# EAGLE board l5 (EAGLE 5.10), part 1 of 2
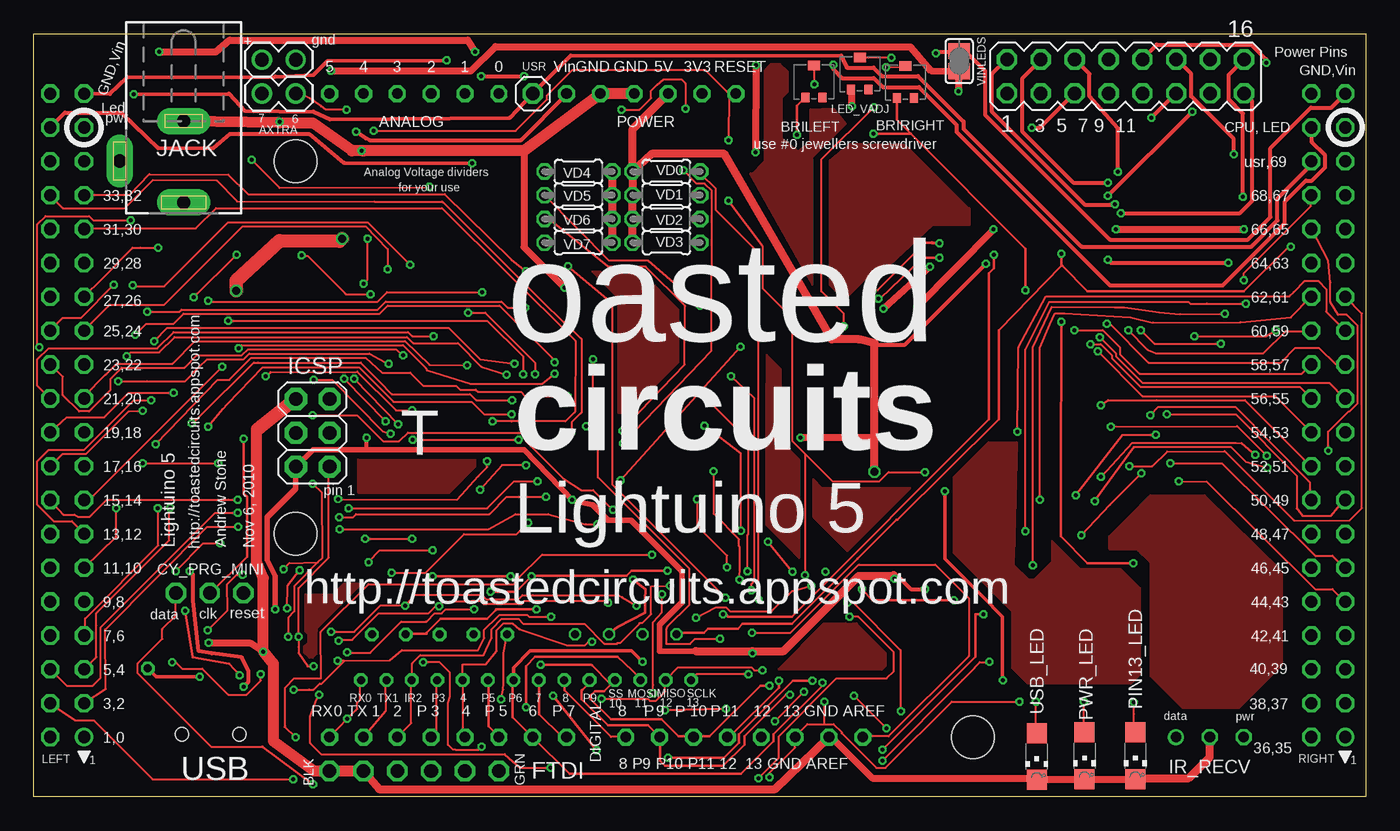
[diagram p2: board, top side]
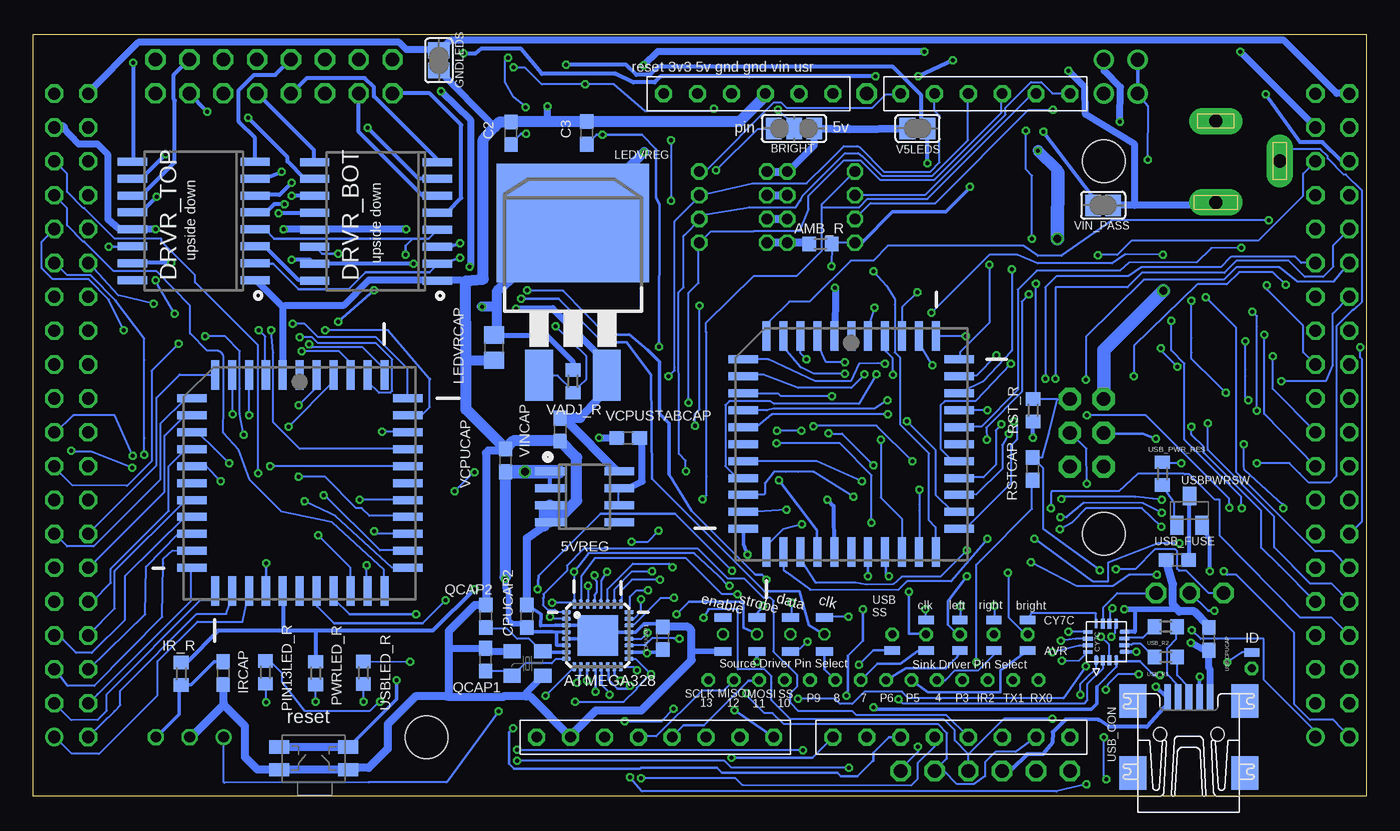
[diagram p3: board, bottom side, seen from below]

Size 100 x 57.14 mm. Coordinates in mm from the lower left corner, seen from the top.
Outline: 0,0 100,0 100,57.14 0,57.14 0,0
Copper layers (1*16): Top 0.035mm / dielectric 1.5mm / Bottom 0.035mm
Design rules "ourpcb *": minimum track width 6mil, minimum drill 0.3mm, track to track 6mil, track to pad 6mil, pad to pad 6mil, via to via 6mil, smd to smd 6mil, copper to edge 0.15mm, drill to drill 8mil, minimum pad ring 0.15mm, minimum via ring 0.15mm, stop-mask expansion 4mil, vias tented up to drill 21mil, thermal gap 10mil
Net classes: 1 PWR: width 0.305 mm, clearance 0.203 mm; 2 GND: width 0.508 mm, clearance 0.203 mm; 3 CHIPCOM: width 0.203 mm, clearance 0.152 mm; 4 solder: clearance 1.524 mm; 5 LEDROW: width 0.305 mm, clearance 0.203 mm; 6 LEDPWR: width 0.381 mm, clearance 0.254 mm

## Footprints (pad centres in the part's own frame; a part is rotated, then mirrored left to right if it is on the bottom)
SO08 = smd 0.6 x 2.2: 1 -1.905,-2.6; 2 -0.635,-2.6; 3 0.635,-2.6; 4 1.905,-2.6; 5 1.905,2.6; 6 0.635,2.6; 7 -0.635,2.6; 8 -1.905,2.6
R0603 = smd 1 x 1.1: 1 -0.85,0; 2 0.85,0
1X02 = drill 1.016 round: 1 0,0; 2 2.54,0
SJ_2 = smd 1.168 x 1.6: 1 -1.524,0; 2 0,0; 3 1.524,0
PVZ2A_TRIM_POT = smd 0.6 x 0.7: P$1 -0.65,-1.2; P$3 0.65,-1.2 | smd 0.9 x 0.7: P$2 0,1.2
RCL_C0603 = smd 1.1 x 1: 1 -0.85,0; 2 0.85,0
MLF32 = smd 0.7 x 0.3: 1 -2.35,1.75; 2 -2.35,1.25; 3 -2.35,0.75; 4 -2.35,0.25; 5 -2.35,-0.25; 6 -2.35,-0.75; 7 -2.35,-1.25; 8 -2.35,-1.75; 17 2.35,-1.75; 18 2.35,-1.25; 19 2.35,-0.75; 20 2.35,-0.25; 21 2.35,0.25; 22 2.35,0.75; 23 2.35,1.25; 24 2.35,1.75 | smd 0.3 x 0.7: 9 -1.75,-2.35; 10 -1.25,-2.35; 11 -0.75,-2.35; 12 -0.25,-2.35; 13 0.25,-2.35; 14 0.75,-2.35; 15 1.25,-2.35; 16 1.75,-2.35; 25 1.75,2.35; 26 1.25,2.35; 27 0.75,2.35; 28 0.25,2.35; 29 -0.25,2.35; 30 -0.75,2.35; 31 -1.25,2.35; 32 -1.75,2.35 | smd 3.048 x 3.048: CENTER 0,0
C0603 = smd 1.1 x 1: 1 -0.85,0; 2 0.85,0
QFN16-3X3 = smd 0.75 x 0.3: P$1 -1.375,0.75; P$2 -1.375,0.25; P$3 -1.375,-0.25; P$10 1.375,-0.25; P$11 1.375,0.25 | smd 0.737 x 0.279: P$4 -1.375,-0.75; P$9 1.375,-0.75; P$12 1.375,0.75 | smd 0.279 x 0.737: P$5 -0.75,-1.375; P$6 -0.25,-1.375; P$7 0.25,-1.375; P$8 0.75,-1.375; P$13 0.75,1.375; P$16 -0.75,1.375 | smd 0.3 x 0.75: P$14 0.25,1.375; P$15 -0.25,1.375
HEADER_3X1 = drill 1.016 octagon: 1 -2.54,0; 2 0,0; 3 2.54,0
SO16W = smd 0.6 x 2.2: 1 -4.445,-4.6; 2 -3.175,-4.6; 3 -1.905,-4.6; 4 -0.635,-4.6; 5 0.635,-4.6; 6 1.905,-4.6; 7 3.175,-4.6; 8 4.445,-4.6; 9 4.445,4.6; 10 3.175,4.6; 11 1.905,4.6; 12 0.635,4.6; 13 -0.635,4.6; 14 -1.905,4.6; 15 -3.175,4.6; 16 -4.445,4.6
1X06-CLEAN = drill 1.016 octagon: 1 -6.35,0; 2 -3.81,0; 3 -1.27,0; 4 1.27,0; 5 3.81,0; 6 6.35,0
SJ = smd 1.168 x 1.6: 1 -0.762,0; 2 0.762,0
2X03 = drill 1.016 pad 1.676 octagon: 1 -2.54,-1.27; 2 -2.54,1.27; 3 0,-1.27; 4 0,1.27; 5 2.54,-1.27; 6 2.54,1.27
TSOP34138 = drill 0.8 round: P$1_OUT -2.54,0 | drill 0.8 octagon: P$2_GND 0,0; P$3_V 2.54,0
DCJ0202 = drill 1 pad 2 long: 1 0,3.1; 2 4.8,0; 3 0,-3
RCL_C0805 = smd 1.3 x 1.5: 1 -0.95,0; 2 0.95,0
D2PACK = smd 2.083 x 3.81: 1 -2.54,-8.89; 3 2.54,-8.89 | smd 11.43 x 8.89: 2 0,2.54
CON-HARTING_CON40L = drill 0.914 round: 1 24.13,1.27 | drill 0.914 octagon: 2 24.13,-1.27; 3 21.59,1.27; 4 21.59,-1.27; 5 19.05,1.27; 6 19.05,-1.27; 7 16.51,1.27; 8 16.51,-1.27; 9 13.97,1.27; 10 13.97,-1.27; 11 11.43,1.27; 12 11.43,-1.27; 13 8.89,1.27; 14 8.89,-1.27; 15 6.35,1.27; 16 6.35,-1.27; 17 3.81,1.27; 18 3.81,-1.27; 19 1.27,1.27; 20 1.27,-1.27; 21 -1.27,1.27; 22 -1.27,-1.27; 23 -3.81,1.27; 24 -3.81,-1.27; 25 -6.35,1.27; 26 -6.35,-1.27; 27 -8.89,1.27; 28 -8.89,-1.27; 29 -11.43,1.27; 30 -11.43,-1.27; 31 -13.97,1.27; 32 -13.97,-1.27; 33 -16.51,1.27; 34 -16.51,-1.27; 35 -19.05,1.27; 36 -19.05,-1.27; 37 -21.59,1.27; 38 -21.59,-1.27; 39 -24.13,1.27; 40 -24.13,-1.27
PLCC44 = smd 0.6 x 2.2: 1 0,8.1; 2 -1.27,8.1; 3 -2.54,8.1; 4 -3.81,8.1; 5 -5.08,8.1; 6 -6.35,8.1; 18 -6.35,-8.1; 19 -5.08,-8.1; 20 -3.81,-8.1; 21 -2.54,-8.1; 22 -1.27,-8.1; 23 0,-8.1; 24 1.27,-8.1; 25 2.54,-8.1; 26 3.81,-8.1; 27 5.08,-8.1; 28 6.35,-8.1; 40 6.35,8.1; 41 5.08,8.1; 42 3.81,8.1; 43 2.54,8.1; 44 1.27,8.1 | smd 2.2 x 0.6: 7 -8.1,6.35; 8 -8.1,5.08; 9 -8.1,3.81; 10 -8.1,2.54; 11 -8.1,1.27; 12 -8.1,0; 13 -8.1,-1.27; 14 -8.1,-2.54; 15 -8.1,-3.81; 16 -8.1,-5.08; 17 -8.1,-6.35; 29 8.1,-6.35; 30 8.1,-5.08; 31 8.1,-3.81; 32 8.1,-2.54; 33 8.1,-1.27; 34 8.1,0; 35 8.1,1.27; 36 8.1,2.54; 37 8.1,3.81; 38 8.1,5.08; 39 8.1,6.35
CHIPLED_1206 = smd 1.5 x 1.5: A 0,-1.75; C 0,1.75
CRYSTAL_ABM8 = smd 1.3 x 1.05: P$1 0,-1.85; P$3 2.3,0; P$GND1 0,0; P$GND2 2.3,-1.85
RA_SWITCH = smd 1.5 x 1: P$1 -2.6,-0.8; P$2 2.6,-0.8; P$3 -2.6,0.9; P$4 2.6,0.9
MA08-2 = drill 1.016 octagon: 1 -8.89,-1.27; 2 -8.89,1.27; 3 -6.35,-1.27; 4 -6.35,1.27; 5 -3.81,-1.27; 6 -3.81,1.27; 7 -1.27,-1.27; 8 -1.27,1.27; 9 1.27,-1.27; 10 1.27,1.27; 11 3.81,-1.27; 12 3.81,1.27; 13 6.35,-1.27; 14 6.35,1.27; 15 8.89,-1.27; 16 8.89,1.27
JUMPER_HOLE_WITH_SMT_DEFAULT_PAD = smd 1.143 x 0.635 bottom: DEFAULT -0.635,1.194 | drill 0.6 pad 1.016 octagon: JPR -0.635,0
SHIELD-OCTAGONALPAD = drill 0.8 pad 1.27 octagon: 0_RX -25.4,27.94; 1_TX -25.4,25.4; 2 -25.4,22.86; 3 -25.4,20.32; 3V3 22.86,0; 4 -25.4,17.78; 5 -25.4,15.24; 5V 22.86,2.54; 6 -25.4,12.7; 7 -25.4,10.16; 8 -25.4,5.715; 9 -25.4,3.175; 10 -25.4,0.635; 11 -25.4,-1.905; 12 -25.4,-4.445; 13 -25.4,-6.985; A_0 22.86,15.24; A_1 22.86,17.78; A_2 22.86,20.32; A_3 22.86,22.86; A_4 22.86,25.4; A_5 22.86,27.94; AREF -25.4,-12.065; GND0 -25.4,-9.525; GND1 22.86,7.62; GND2 22.86,5.08; RESET 22.86,-2.54; VIN 22.86,10.16 | hole 3.2: 17.78,30.48; -10.16,30.48; -25.4,-20.32
LEDSRCSEL = smd 1.27 x 0.635: 1_CLK_DFLT -6.35,1.27; 1_CLK_DFLT1 -6.35,-1.27; 2_DATA_DFLT -3.81,1.27; 2_DATA_DFLT1 -3.81,-1.27; 3_STROBE_DFLT -1.27,1.27; 3_STROBE_DFLT1 -1.27,-1.27; 4_ENA_DFLT 1.27,1.27; 4_ENA_DFLT1 1.27,-1.27 | drill 0.6 octagon: P$1 -6.35,0; P$2 -3.81,0; P$3 1.27,0; P$4 -1.27,0
DUINO_DIGITAL_SOLDER_PTS = drill 0.6 pad 1.016 octagon: IN0 -12.065,-0.635; IN1 -10.16,-0.635; IN2 -8.255,-0.635; IN3 -6.35,-0.635; IN4 -4.445,-0.635; IN5 -2.54,-0.635; IN6 -0.635,-0.635; IN7 1.27,-0.635; IN8 3.175,-0.635; IN9 5.08,-0.635; IN10 6.985,-0.635; IN11 8.89,-0.635; IN12 10.795,-0.635; IN13 12.7,-0.635
QUAD_SOLDER_PTS_WITH_2_DEFAULTS = drill 0.6 pad 1.016 octagon: OUT0 -4.445,0; OUT1 -1.905,0; OUT2 0.635,0; OUT3 3.175,0 | smd 1.143 x 0.635 bottom: OUT0_DFLT -4.445,1.194; OUT0_DFLT1 -4.445,-1.092; OUT1_DFLT -1.905,1.194; OUT1_DFLT1 -1.905,-1.092; OUT2_DFLT 0.635,1.194; OUT2_DFLT1 0.635,-1.092; OUT3_DFLT 3.175,1.194; OUT3_DFLT1 3.175,-1.092
SAMTEC_MUSB_05 = smd 2 x 0.5: 1 2.25,1.6; 2 2.25,0.8; 3 2.25,0; 4 2.25,-0.8; 5 2.25,-1.6 | smd 2.5 x 2: M1 -3.4,-4.2; M2 -3.4,4.2; M3 2,4.2; M4 2,-4.2 | hole 1: -0.5,-2.15; -0.5,2.15
SOT23-BEC = smd 1 x 1.4: B -0.95,-1.1; C 0,1.1; E 0.95,-1.1
1X01 = drill 1.016 octagon: 1 0,0
RCL_R0603 = smd 1 x 1.1: 1 -0.85,0; 2 0.85,0
0204/5 = drill 0.813 octagon: 1 -2.54,0; 2 2.54,0

## Placement (x,y rotation side)
5VREG  SPX2954  [SO08]  58.65,22.48 270 bottom
AMB_R  10k  [R0603]  40.94,41.43 180 bottom
AMS302  Light sensor  [1X02]  17.14,55.24 0 top
AXTRA  [1X02]  19.68,52.71 180 top
BRIGHT  Brightness control selector  [SJ_2]  42.93,50.09 180 bottom
BRILEFT  10k  [PVZ2A_TRIM_POT]  58.57,53.62 0 top
BRIRIGHT  10k  [PVZ2A_TRIM_POT]  65.43,53.57 0 top
C2  1nF  [RCL_C0603]  64.16,49.73 90 bottom
C3  1nF  [RCL_C0603]  58.47,49.76 90 bottom
CPU  MEGA48/88/168  [MLF32]  57.66,12.06 0 bottom
CPUCAP1  .1uF  [C0603]  52.78,11.86 90 bottom
CPUCAP2  .1uF  [C0603]  62.97,13.51 90 bottom
CY7C64316  USB_CPU_CY7C64315  [QFN16-3X3]  19.51,11.58 90 bottom
CY_PRG_MINI  CY_PRG_MIN  [HEADER_3X1]  13.23,15.24 180 top
DRVR_BOT  MIC5891  [SO16W]  74.3,43.13 90 bottom
DRVR_TOP  MIC5891  [SO16W]  87.96,43.15 90 bottom
FTDI  [1X06-CLEAN]  28.57,1.91 0 top
GNDLEDS  [SJ]  69.57,55.19 90 bottom
ICSP  [2X03]  20.96,27.26 90 top
IR_R  100  [R0603]  88.9,9.19 90 bottom
IR_RECV  TSOP34138_IR_RECIEVER  [TSOP34138]  88.27,4.45 0 top
IRCAP  0.1uF  [RCL_C0603]  85.75,9.25 270 bottom
JACK  DCJ0202  [DCJ0202]  11.28,47.65 180 top
LED_VADJ  Led Voltage Adjust  [PVZ2A_TRIM_POT]  62,54.2 0 top
LEDVRCAP  4.7uF  [RCL_C0805]  65.43,33.66 270 bottom
LEDVREG  [D2PACK]  59.51,40.46 0 bottom
LEFT  [CON-HARTING_CON40L]  2.54,28.57 270 top
M5451_LEFT  STONE_ST-M5451  [PLCC44]  38.63,26.42 0 bottom
M5451_RIGHT  STONE_ST-M5451  [PLCC44]  80.01,23.49 0 bottom
PIN13_LED  [CHIPLED_1206]  82.68,3.05 180 top
PIN13LED_R  1K  [R0603]  82.58,9.3 270 bottom
PWR_LED  [CHIPLED_1206]  78.87,3.05 180 top
PWRLED_R  1K  [R0603]  78.82,9.25 270 bottom
Q1  ABM8  [CRYSTAL_ABM8]  64.08,10.9 0 bottom
QCAP1  33pf  [C0603]  66.07,10.26 90 bottom
QCAP2  33pF  [C0603]  66.04,13.51 90 bottom
RESET_SWITCH  RA_SWITCH  [RA_SWITCH]  78.97,2.79 0 bottom
RIGHT  [CON-HARTING_CON40L]  97.16,28.57 270 top
ROW_DRIVER  Source driver  [MA08-2]  81.94,54 0 top
RST_R  10K  [R0603]  24.99,28.96 90 bottom
RSTCAP  1nF  [RCL_C0603]  25.02,24.56 90 bottom
SJ1  [JUMPER_HOLE_WITH_SMT_DEFAULT_PAD]  34.92,12.14 180 top
U$3  ARDUINO-USBOCTAGONAL_PADS  [SHIELD-OCTAGONALPAD]  50.16,29.84 90 top
U$5  LEDSRCSEL  [LEDSRCSEL]  46.99,12.14 180 bottom
U$6  DUINO_DIGITAL_SOLDER_PTS  [DUINO_DIGITAL_SOLDER_PTS]  36.65,9.35 0 top
U$7  QUAD_SOLDER_PTS_WITH_2_DEFAULTS  [QUAD_SOLDER_PTS_WITH_2_DEFAULTS]  28.57,12.14 180 top
USB_CON  MINI-USB-SAMTEC  [SAMTEC_MUSB_05]  13.31,5.16 90 bottom
USB_FUSE  PTC-  [RCL_C0603]  14.17,17.73 0 bottom
USB_LED  [CHIPLED_1206]  75.29,3 180 top
USB_PWR_RES  2.5k  [R0603]  15.29,24.21 270 bottom
USB_R1  22  [R0603]  15.04,10.44 180 bottom
USB_R2  22  [R0603]  15.04,12.73 180 bottom
USBCPUCAP  .1uF  [C0603]  11.81,11.81 270 bottom
USBID  usb id  [JUMPER_HOLE_WITH_SMT_DEFAULT_PAD]  9.22,9.6 0 top
USBLED_R  1K  [R0603]  75.23,9.27 270 bottom
USBPWRSW  MMBT540LT1SMD  [SOT23-BEC]  13.26,21.44 0 bottom
USR  [1X01]  37.47,52.71 0 top
V5LEDS  [SJ]  33.66,50.09 0 bottom
VADJ_R  470  [RCL_R0603]  59.51,31.12 270 bottom
VCPUCAP  >=3.3uF  [RCL_C0603]  64.57,25.2 90 bottom
VCPUSTABCAP  .01uF  [C0603]  55.37,26.87 0 bottom
VD0  [0204/5]  47.5,46.86 0 top
VD1  [0204/5]  47.5,45.09 0 top
VD2  [0204/5]  47.5,43.31 0 top
VD3  [0204/5]  47.5,41.53 0 top
VD4  [0204/5]  40.89,46.86 180 top
VD5  [0204/5]  40.89,45.09 180 top
VD6  [0204/5]  40.89,43.31 180 top
VD7  [0204/5]  40.89,41.53 180 top
VIN_PASS  [SJ]  19.74,44.32 180 bottom
VINCAP  >1uF  [C0603]  60.48,27.51 270 bottom
VINLEDS  [SJ]  69.47,55.14 90 top

## Tracks (layer width: path | path; a pad name or v marks a point on that pad's centre or on a via)
+5V  (via drill 0.3, 0.6)
  Top 0.305: v71.48,39.93 65.41,33.88 63.27,33.88 63.12,33.98 | v89.66,40.01 80.85,40.01 v80.62,40.23 | 24.99,26.01 v24.99,26.9 | 53.95,10.9 v53.95,10.74 | 40.51,22.16 v40.44,22.25 | v66.9,15.54 65.84,15.54 64.85,16.54 64.57,16.61 | 64.49,16.54 v64.62,16.31
  Top 0.406: v18.16,14.02 18.16,16.51 17.55,17.75 17.55,20.93 19.69,23.07 ICSP.2 20.98,26.01 24.99,26.01 36.83,26.01 40.51,22.16 41.96,21.87 43.1,20.7 44.86,20.7 48.67,16.87 48.67,14.55 46.99,12.85 46.99,10.9 49.68,10.9
  Top 0.508: 63.12,26.9 v57.56,26.9
  Top 0.61: U$3.5V 44.96,50.04 VD0.1 | v63.12,24.36 63.12,26.9 63.12,33.98 61.92,34.27 59.92,34.27 58.37,36.96 51.84,48.18 46.41,48.18 VD0.1 | 49.68,10.9 53.95,10.9 56.29,10.9 61.92,16.54 64.49,16.54 64.57,16.61 | VD3.1 VD2.1 VD1.1 | VD4.1 VD7.1 | VD0.1 44.96,45.11 44.91,45.06
  Bottom 0.254: CPU.18 53.95,10.81 52.55,10.81 CPUCAP1.1 | 61.06,12.34 CPU.4 | 61.06,12.34 62.61,12.34 62.75,12.88 CPUCAP2.1 | CPU.6 60.01,11.33 60.76,11.33 60.76,12.31 61.06,12.34
  Bottom 0.305: 56.24,26.9 VCPUSTABCAP.1 | 5VREG.2 61.27,23.16 61.27,23.85 61.26,24.34 | 5VREG.1 61.27,24.38 61.27,24.34 | v71.48,39.93 78.87,39.93 DRVR_BOT.15 79.02,40.01 79.25,40.23 v80.62,40.23 | v89.66,40.01 92.51,40.01 DRVR_TOP.15 | 78.82,12.42 81.23,12.42 | 81.23,12.42 81.23,14.71 81.23,15.39 M5451_RIGHT.22 | 78.82,12.42 PWRLED_R.1 | IR_R.2 88.88,10.06 88.47,10.06 86.13,12.42 81.23,12.42 | 78.82,12.42 81.23,12.42 | CY7C64316.P$8 17.37,12.34 17.37,14.02 v18.16,14.02 | v24.99,26.9 RST_R.1 | v53.95,10.74 53.95,10.81 | v40.44,22.25 39.95,21.77 39.93,18.36 M5451_LEFT.22 | 78.82,12.42 70.03,12.42 v66.9,15.54 | 78.82,12.42 78.79,12.42 78.82,12.42 | 78.82,12.42 81.23,12.42 | 43.47,43.24 43.51,43.28 VD6.1 | VD4.1 43.2,47.02 | BRIGHT.1 41.53,49.84
  Bottom 0.406: 64.62,16.43 v64.62,16.31 64.62,15.65 64.34,15.37 64.34,13.21 64.06,12.93 63.23,12.93 CPUCAP2.1 | v18.16,14.02 17.37,14.02 14.24,14.02 14.38,14.26
  Bottom 0.508: v57.56,26.9 56.24,26.9 | 43.2,47.02 42.06,48.16 41.4,48.82 BRIGHT.1
  Bottom 0.61: VD1.1 VD5.1 | VD0.1 VD4.1 | VD2.1 VD6.1 | VD3.1 VD7.1 43.43,41.55 41.91,41.55 41.91,41.43 AMB_R.2 | BRIGHT.1 38.79,50.04 V5LEDS.1 | 11.96,12.66 USBCPUCAP.1 11.81,12.78 12.9,13.87 14.02,13.87 14.38,14.26 14.5,14.4 14.5,15.91 USB_FUSE.1 | 60.54,24.33 63.09,24.33 v63.12,24.36 | 43.43,43.28 43.47,43.24 43.48,43.23
  Bottom 0.813: VCPUCAP.1 64.57,16.48 64.62,16.43
  Bottom 1.016: VCPUCAP.1 61.27,24.34 61.26,24.34 61.19,24.34 61.19,24.33 60.54,24.33
BRIGHT_NET  (via drill 0.3)
  Top 0.152: v48.77,46.94 49.76,45.95 50.37,45.95 50.9,45.41 50.88,33.43 v44.25,26.47 | v26.87,16.76 26.9,16.76 29.41,16.76 32.31,19.66 36.27,19.66 37.11,20.5 v37.13,20.52
  Bottom 0.152: v48.77,46.94 45.64,50.06 44.5,50.06 BRIGHT.3 | v44.25,26.47 39.47,26.47 37.11,24.08 v37.13,20.52 | v26.87,16.76 26.82,16.76 26.82,13.41 25.6,12.19 25.45,12.19 U$7.OUT3
BRISEL0  (via drill 0.3)
  Top 0.203: 64.77,52.35 BRIRIGHT.P$1 64.78,50.74 65.84,49.68 | v82.53,17.5 79.1,17.5 77.09,19.51 77.09,22.1 77.09,23.6 v77.11,35.59 | v74.45,37.95 74.45,41.07 65.84,49.68 | 65.84,49.68 v63.02,49.68
  Bottom 0.203: v63.02,49.68 63.4,49.68 64.16,48.92 C2.1 | v82.53,17.5 82.53,15.47 M5451_RIGHT.21 | v77.11,35.59 v74.45,37.95
BRISEL1  (via drill 0.3)
  Top 0.203: BRILEFT.P$1 57.3,51.8 v57.3,49.61 | v44.07,23.7 v53.06,33.71
  Bottom 0.203: C3.1 58.45,48.92 57.76,49.61 v57.3,49.61 54.33,49.61 53.26,48.54 53.26,44.88 53.03,44.42 v53.06,33.71 | v44.07,23.7 41.22,19.96 41.22,18.36 M5451_LEFT.21
CLK  (via drill 0.3)
  Top 0.203: v34.29,15.34 36.27,15.35 | 36.27,15.35 36.28,15.35 | v62.15,15.54 62.94,14.71 v69.06,14.71 | v37.36,16.51 37.41,16.54 | v37.36,16.51 37.34,16.46 36.27,15.39 36.27,15.35 | v37.36,16.51 37.49,16.54 44.5,16.54 44.88,16.92 47.55,16.92 v47.57,16.92
  Bottom 0.203: v34.29,15.34 34.29,12.19 33.07,12.19 U$7.OUT0 | v37.36,16.51 37.34,18.29 M5451_LEFT.24 | v62.15,15.54 62.1,16.54 57.45,21.18 51.87,21.18 v47.57,16.92 | M5451_RIGHT.24 78.72,15.39 78.72,14.25 77.44,12.98 70.79,12.98 v69.06,14.71
CLK1
  Bottom 0.152: QCAP2.1 65.99,12.57 64.47,12.57 63.7,11.81 62.79,11.81 61.87,10.9 Q1.P$3
  Bottom 0.254: CPU.7 61.7,10.81 Q1.P$3
CLK2
  Bottom 0.152: 63.7,9.37 64.01,9.07 Q1.P$1 63.7,9.37 | 63.7,9.37 63.09,9.98 61.11,9.98 60.81,10.29 60.05,10.29 CPU.8 | 63.7,9.37 65.99,9.37 QCAP1.1
CPUVOLTAGESEL2IDE  (via drill 0.3)
  Top 0.305: v32.92,47.47 23.29,47.52 20.68,49.68 14.76,49.68 13.51,48.64 9.37,48.62 6.6,51.26 2.36,51.28 1.29,50.22 LEFT.38 | v60.02,54.86 60.02,54.53 60.68,53.87 63.07,53.87 63.75,53.19 66.45,53.19 69.27,50.37 69.27,49.84 80.77,38.33 89.23,38.33 93.88,42.98 93.88,44.58 95.48,46.18 95.94,46.18 96.93,47.17 96.93,48.08 95.94,49.07 95.94,50.14 RIGHT.38
  Bottom 0.305: v32.92,47.47 32.92,50.06 V5LEDS.2 32.92,50.22 33.38,50.67 33.38,52.58 35.51,54.71 53.09,54.74 53.72,54.1 54.76,54.1 55.52,54.86 v60.02,54.86
DATA0  (via drill 0.3)
  Top 0.203: v58.45,8.69 57,8.69 52.96,4.65 52.96,4.04 51.82,2.9 v47.62,2.9 | U$6.IN7 37.95,8.69 37.95,6.17 39.62,4.5 40.01,4.5 U$3.7
  Bottom 0.203: U$7.OUT0_DFLT 33.07,10.9 33.68,10.9 34.95,9.96 36.68,9.96 U$6.IN7 | v58.45,8.69 58.45,9.68 CPU.11 | v47.62,2.9 41.53,2.9 40.01,4.42 U$3.7
DATA1  (via drill 0.3)
  Top 0.203: v64.01,5.11 v61.57,7.54 | U$6.IN5 34.14,8.69 34.14,5.26 34.9,4.5 U$3.5
  Bottom 0.203: U$7.OUT3_DFLT 25.45,10.9 27.43,9.45 27.43,7.8 32.89,7.8 U$6.IN5 | v61.57,7.54 59.44,9.68 CPU.9 | v64.01,5.11 64.31,4.8 64.31,3.73 64.31,2.44 63.93,2.06 54.48,2.06 54.41,2.13 48.69,2.13 48.34,1.78 39.67,1.78 39.4,1.5 38.15,1.5 37.03,2.62 36.96,2.67 36.96,3.28 35.81,4.42 35.05,4.42 U$3.5 34.98,4.42
GND  (via drill 0.3, 0.6)
  Top 0.254: 17.25,10.9 v17.25,10.85
  Top 0.508: v61.42,51.74 61.42,52.96 LED_VADJ.P$1 | v13.16,11.53 16.26,11.51 17.25,10.9 | 18.43,50.51 v18.47,50.6 | U$3.GND0 59.97,4.34 62.94,1.37 75.06,1.37 USB_LED.C 75.29,1.29 PWR_LED.C 79.1,1.29 PIN13_LED.C 82.91,1.37 | 17.06,27.71 16.92,27.89 16.74,27.56 | 36.8,48.41 36.8,41.2 v39.85,38.15
  Top 0.61: U$3.GND0 55.65,0.53 25.93,0.53 24.77,1.88 FTDI.2 | IR_RECV.P$2_GND 88.27,2.95 86.69,1.37 82.91,1.37 82.75,1.37
  Top 0.813: JACK.3 18.43,50.51 19.44,50.49 20.98,50.49 23.9,48.41 36.8,48.41 U$3.GND1 U$3.GND2 | 16.74,27.56 16.74,17.58 17.25,16.38 17.25,10.9 18.01,9.96 18.01,4.17 21.05,1.91 FTDI.1 FTDI.2 | v24.61,48.44 24.89,48.44
  Top 1.016: v15.21,37.92 15.21,38.66 18.47,41.66 22.99,41.63 v23.16,41.81 | 16.84,27.54 17.06,27.71 ICSP.6
  Bottom 0.254: CPUCAP1.2 52.93,12.71 52.93,12.93 54.17,12.94 54.81,12.29 55.29,12.29 CPU.21 57.41,12.31 CPU.CENTER | CPUCAP2.2 61.91,13.66 61.92,12.8 60.85,12.81 CPU.3 58.41,12.81 CPU.CENTER | CPU.5 58.62,11.81 58.62,12.06 CPU.CENTER | CY7C64316.P$5 17.23,10.83 v17.25,10.85
  Bottom 0.406: U$5.4_ENA_DFLT 48.28,10.9 50.62,10.9
  Bottom 0.508: 85.75,8.38 IRCAP.2 85.72,8.46 85.72,8.37 | 81.31,36.73 81.31,31.62 M5451_RIGHT.2 | 81.31,36.73 83.29,38.71 DRVR_TOP.1 | USB_CON.5 11.71,7.47 11.71,7.54 11.71,9.42 11.81,9.68 USBCPUCAP.2 12.04,10.9 v13.16,11.53 | 61.42,50.62 v61.42,51.74 | C3.2 58.45,50.67 58.45,50.62 | 68.83,11.12 QCAP1.2 65.99,10.9 Q1.P$GND1 | Q1.P$GND2 61.8,8.99 63.02,7.77 63.02,7.49 | 65.46,32.69 LEDVRCAP.2 | 67.55,32.67 67.21,32.69 | GNDLEDS.1 69.57,54.41 65.38,50.22 | 39.83,38.09 39.85,34.52 M5451_LEFT.2 | 39.83,38.09 39.83,38.15 | 67.56,38.66 67.97,38.71 69.65,38.71 DRVR_BOT.1 69.95,38.71 74.83,38.71 76.73,36.8 81.08,36.8 81.31,36.73 | v18.47,50.6 18.44,53.19 19.66,54.41 19.66,55.24 AMS302.2 | 82.07,2.13 81.84,2.13 RESET_SWITCH.P$1 82.22,1.98 82.22,2.01 | 75.67,2.13 76.12,2.13 RESET_SWITCH.P$2 | 85.72,6.86 85.72,7.09 | 39.83,38.09 39.85,38.1 v39.85,38.15
  Bottom 0.61: CPUCAP2.2 62.97,19.36 61.65,20.29 5VREG.4 | CPUCAP1.2 50.89,12.71 50.62,12.45 50.62,10.9 50.62,10.26 50.6,10.24 54.38,6.45 57.78,6.45 59.69,4.55 U$3.GND0 62.74,7.49 63.02,7.49 64.73,7.49 | 64.73,7.47 68.83,7.47 68.83,7.67 | VCPUCAP.2 64.68,25.93 65.86,25.93 66.04,25.76 QCAP2.2 66.05,14.35 66.88,14.35 68.83,12.39 68.83,11.12 68.83,8.69 68.83,7.67 | RESET_SWITCH.P$2 RESET_SWITCH.P$1 | 88.16,4.45 85.72,6.88 85.72,7.09 85.72,8.37 | 85.72,6.86 84.12,5.26 84.12,2.95 83.19,2.01 82.22,2.01 81.56,2.01 | 75.67,2.13 74.83,2.13 73.41,3.56 73.41,5.41 71.32,7.49 69.01,7.49 68.83,7.67
  Bottom 0.762: 67.21,32.69 65.46,32.69
  Bottom 0.813: U$3.GND2 45.09,52.53 46.99,50.62 58.45,50.62 61.42,50.62 64.12,50.62 C2.2 65.01,50.58 65.38,50.22 66.24,49.25 66.24,38.79 67.56,38.66 67.55,32.67 67.54,29.03 64.57,26.09 | 64.57,26.09 VCPUCAP.2 | 64.57,26.09 63.99,26.66 VINCAP.2 59.23,25.41 59.23,22.17 60.3,21.11 61.29,21.11 61.25,21.07 5VREG.4 | 5VREG.3 61.65,21.44 61.65,20.29 | 23.14,46.79 23.14,46.96 v24.61,48.44
  Bottom 1.016: ICSP.6 19.69,33.44 v15.21,37.92 | v23.16,41.81 23.14,46.79
GND3
  Bottom 0.508: RIGHT.40 95.94,52.73 92.13,56.54 72.54,56.54 72.01,56.01 69.57,56.01 GNDLEDS.2 69.34,56.08 68.73,56.69 6.17,56.69 2.21,52.73 1.29,52.73 LEFT.40
LEDPWR  (via drill 0.3)
  Top 0.508: v81.23,42.52 v90.83,42.52 | v9.45,55.85 13.72,55.83 14.73,56.72 32.59,56.72 v33.15,55.85 | v54.2,54.84 v54.18,48.31 | v72.03,42.52 72.06,42.52 v66.34,36.73
  Bottom 0.381: 78.94,42.52 DRVR_BOT.13 78.72,42.52 | 93.55,42.57 92.73,42.6 DRVR_TOP.13 | 98.37,50.16 RIGHT.37 | VADJ_R.1 59.51,32.61 61.49,34.59 65.23,34.59 65.38,34.59 LEDVRCAP.1 | LEFT.37 3.81,50.22 | 59.51,42.98 LEDVREG.2 59.59,42.82 | 65.23,37.87 65.23,36.73
  Bottom 0.508: 78.94,42.52 v81.23,42.52 | v90.83,42.52 DRVR_TOP.13 | 97.79,50.16 96.6,48.92 95.17,48.92 94.39,48.11 94.39,43.28 93.55,42.57 | 3.81,50.22 v9.45,55.85 | v33.15,55.85 53.16,55.85 v54.2,54.84 | v72.03,42.52 78.72,42.52
  Bottom 0.762: 97.79,50.16 98.37,50.16 | v54.18,48.31 59.51,42.98 | 59.59,42.82 65.23,37.87 65.23,36.73 | 65.23,36.73 65.23,34.59 | 65.23,36.73 v66.34,36.73
LEFTDATA  (via drill 0.3)
  Top 0.203: v29.95,16.51 v35.81,16.51
  Bottom 0.203: v29.95,16.51 31.39,14.63 31.39,12.88 30.71,12.19 30.48,12.19 U$7.OUT1 | M5451_LEFT.25 36.04,18.29 36.04,17.75 36.04,17.25 36.04,16.74 v35.81,16.51
MISO  (via drill 0.3)
  Top 0.152: v54.71,9.45 54.1,9.45 53.87,9.68 48.39,9.68 47.47,8.76 U$6.IN12 | ICSP.1 22.17,24.69 22.17,17.91 19.89,15.62 v19.89,11.96 19.89,11.2 19.89,10.74 20.57,9.75 v21.03,9.75 | U$6.IN12 47.4,8.69 | v42.62,7.31 42.67,7.31 46.1,7.31 46.25,7.16 46.71,7.16 47.4,7.85 47.4,8.61 U$6.IN12
  Bottom 0.152: v54.71,9.45 54.94,9.68 55.85,9.68 CPU.16 | U$3.12 54.56,4.5 53.26,4.5 49.84,7.93 48.23,7.93 U$6.IN12 | v19.89,11.96 19.28,11.35 19.28,10.21 CY7C64316.P$3 | v42.62,7.31 39.85,7.31 39.47,6.93 38.56,6.93 37.64,7.85 37.57,7.85 34.82,7.85 34.37,7.39 34.31,7.37 22.73,7.34 v21.03,9.75
MOSI  (via drill 0.3)
  Top 0.203: v55.93,8.69 55.93,8.15 52.27,4.5 52.12,4.5 U$3.11 | v15.47,9.07 14.71,9.93 11.96,10.44 11.4,13.89 v11.38,13.92 | v15.77,26.82 15.77,22.71 16.03,22.48 16.03,17.98 13.26,15.24 CY_PRG_MINI.2 | v36.96,6.68 36.96,9.75 37.64,10.46 43.81,10.46 45.49,8.91 45.49,8.76 U$6.IN11
  Bottom 0.203: v55.93,8.69 56.39,9.14 56.39,9.68 CPU.15 | U$6.IN11 45.57,8.69 46.33,8.69 49.68,5.33 51.21,5.33 52.05,4.5 U$3.11 | 18.75,10.13 16.99,10.13 15.93,9.07 v15.47,9.07 | v11.38,13.92 11.84,13.92 13.18,15.24 CY_PRG_MINI.2 | 18.75,10.13 CY7C64316.P$4 | v15.77,26.82 16.76,27.2 19.66,27.2 ICSP.4 | 20.22,8.23 18.75,9.7 18.75,10.13
  Bottom 0.254: 20.22,8.23 20.22,6.93 20.62,6.53 36.27,6.53 36.8,6.53 arc90 v36.96,6.68
N$1  (via drill 0.3)
  Top 0.152: v82.55,7.06 82.58,6.17 82.58,4.8 PIN13_LED.A
  Bottom 0.152: v82.55,7.06 82.55,8.38 PIN13LED_R.2
N$2  (via drill 0.3)
  Top 0.152: v63.98,54.69 65.38,54.71 BRIRIGHT.P$2 | v58.6,53.39 58.6,54.79 BRILEFT.P$2 | v44.12,51.51 45.47,51.51 46.35,52.37 46.35,52.93 46.79,53.37 47.27,53.77 48.62,53.77 48.92,53.47 48.92,51.61 v48.95,51.59
  Bottom 0.152: v44.12,51.51 42.98,50.37 42.98,50.14 BRIGHT.2 | v48.95,51.59 49.25,51.38 54.08,51.36 56.46,53.42 58.6,53.42 v58.6,53.39 61.82,53.39 61.87,53.42 63.09,54.63 63.93,54.63 v63.98,54.69
N$3  (via drill 0.3)
  Top 0.152: 47.5,11.43 47.5,11.48 | 47.5,11.43 47.5,11.48 | 47.5,11.48 47.5,12.55 47.6,12.75 49.23,14.38 49.23,17.07 42.37,23.93 42.37,24 42.37,27.36 v42.37,27.41 | v44.22,27.41 44.65,27.96 48.87,32.38 48.9,36.78 45.95,39.73 43.13,39.73 38.71,43.28 38.41,43.28 VD6.2 | v23.5,51.49 21.92,51.51 21.59,51.74 20.73,52.37 19.89,52.76 19.74,52.73 AXTRA.1 | v51.54,11.81 51.51,11.81 49.66,11.81 49.28,11.43 47.55,11.43 47.5,11.43
  Bottom 0.152: CPU.19 54.1,11.33 53.57,11.86 51.97,11.86 | 51.97,11.86 51.87,11.86 | v51.54,11.81 51.56,11.81 51.97,11.86 | v42.37,27.41 v44.22,27.41 | v23.5,51.49 25.35,51.49 32.33,44.5 37.19,44.5 38.33,43.36 VD6.2
N$4  (via drill 0.3)
  Top 0.305: v24.21,49.86 24.97,49.35 25.22,49.23 36.58,49.23 40.01,52.65 U$3.VIN
  Bottom 0.305: v24.21,49.86 20.5,44.96 VIN_PASS.2
N$5  (via drill 0.3)
  Top 0.152: v40.11,39.75 43.28,37.13 43.36,37.11 43.43,37.03 43.43,23.39 43.46,23.37 43.51,23.32 49.45,17.37 51.89,14.93 v51.92,14.88 | v16.38,47.73 18.47,45.64 29.64,45.67 | 29.64,45.67 29.79,45.57 | v29.72,45.72 29.72,45.57 29.64,45.67
  Bottom 0.152: v40.11,39.75 40.08,41.38 AMB_R.1 40.01,41.38 39.85,41.53 VD7.2 | CPU.22 55.24,12.88 54.94,12.88 52.96,14.86 51.97,14.86 v51.92,14.88 | v16.38,47.73 16.36,51.74 AXTRA.2 | v29.72,45.72 29.72,45.64 29.72,45.66
  Bottom 0.254: AXTRA.2 AMS302.1 | VD7.2 37.85,41.53 35.53,43.84 31.54,43.84 29.72,45.66
N$6
  Bottom 0.152: M5451_RIGHT.20 84.3,13.08 87.68,13.11 90.63,10.18 90.68,10.13 90.68,7.59 95.1,3.18 95.1,3.2 95.12,3.2 97.1,3.2 98.37,4.42 RIGHT.1
N$7
  Bottom 0.152: M5451_RIGHT.19 85.11,15.39 85.11,14.86 85.52,13.69 87.76,13.69 93.47,7.93 93.47,6.83 93.9,6.4 95.86,4.5 RIGHT.2
N$8
  Bottom 0.152: M5451_RIGHT.18 86.41,15.39 86.18,14.73 86.77,14.73 87.43,14.73 94.49,7.67 94.49,6.43 95.17,5.74 97.16,5.71 RIGHT.3
N$9
  Bottom 0.152: M5451_RIGHT.17 88.16,17.14 88.16,14.68 95.17,7.67 95.86,7.01 RIGHT.4
N$10
  Bottom 0.152: M5451_RIGHT.16 88.09,18.36 87.55,18.36 89.56,18.44 90.25,17.83 90.25,17.45 90.32,13.46 95.43,8.28 97.41,8.28 98.37,9.52 RIGHT.5
N$11
  Bottom 0.152: M5451_RIGHT.15 88.16,19.66 89.15,19.66 91.54,17.22 91.59,13.64 95.86,9.52 RIGHT.6
N$12
  Bottom 0.152: M5451_RIGHT.14 88.62,20.95 93.12,16.54 93.12,13.26 95.61,10.77 96.8,10.77 98.09,12.06 RIGHT.7
N$13
  Bottom 0.152: M5451_RIGHT.13 88.16,22.17 88.62,22.17 93.88,16.92 93.88,14.1 95.86,12.12 RIGHT.8
N$14  (via drill 0.3)
  Top 0.152: v85.93,23.65 88.04,23.6 96.16,15.54 97.46,15.54 98.37,14.63 RIGHT.9
  Bottom 0.152: v85.93,23.65 87.02,24.77 M5451_RIGHT.11
N$15
  Bottom 0.152: M5451_RIGHT.10 88.16,25.98 88.62,25.98 89.84,24.77 89.84,21.41 94.18,17.07 94.18,16 95.56,14.63 95.86,14.63 RIGHT.10
N$16
  Bottom 0.305: DRVR_BOT.5 69.65,43.81 68.96,43.81 67.89,44.88 67.89,50.37 70.26,52.73 ROW_DRIVER.1
N$17  (via drill 0.3)
  Top 0.152: v85.29,24.99 89.18,24.97 96.16,18.06 97.46,18.06 98.37,17.14 RIGHT.11
  Bottom 0.152: M5451_RIGHT.9 88.09,27.28 87.63,27.28 86.41,26.06 v85.29,24.99
N$18
  Bottom 0.152: M5451_RIGHT.8 88.62,28.57 90.14,27.05 90.14,22.86 95.86,17.14 RIGHT.12
N$19
  Bottom 0.152: M5451_RIGHT.7 88.16,29.79 88.62,29.79 90.45,27.96 90.45,23.77 95.48,18.74 97.46,18.74 98.37,19.66 RIGHT.13
N$20
  Bottom 0.152: 86.41,31.62 M5451_RIGHT.6 86.49,31.62 89,31.62 89.03,31.62 90.75,29.9 90.75,24.84 95.86,19.74 RIGHT.14
N$21  (via drill 0.3)
  Top 0.152: v85.04,28.65 90.22,28.65 94.69,24.16 94.79,24.05 94.79,21.59 95.22,21.06 97.38,21.06 98.37,22.25 RIGHT.15
  Bottom 0.152: v85.04,28.65 85.04,31.55 M5451_RIGHT.5
N$22  (via drill 0.3)
  Top 0.152: v83.82,28.6 84.4,29.21 90.17,29.21 95.78,23.55 95.78,22.33 RIGHT.16
  Bottom 0.152: v83.82,28.6 83.82,29.87 M5451_RIGHT.4
N$23  (via drill 0.3)
  Top 0.152: v83.08,34.98 84.12,33.96 v89.1,33.96
  Bottom 0.152: v89.1,33.96 89.08,33.96 91.14,31.9 91.11,25.15 92.96,23.29 97.08,23.32 98.37,24.61 98.37,24.77 RIGHT.17 | M5451_RIGHT.3 82.6,31.62 82.6,34.49 v83.08,34.98
N$24  (via drill 0.3)
  Top 0.152: v80.09,29.34 80.62,29.72 84.28,29.72 90.91,29.72 95.86,24.77 RIGHT.18
  Bottom 0.152: v80.09,29.34 78.79,30.63 78.79,31.55 M5451_RIGHT.44
N$25  (via drill 0.3)
  Top 0.152: v80.85,27.74 90.32,27.76 v92.53,25.53
  Bottom 0.152: v80.85,27.74 77.5,31.09 77.5,31.55 M5451_RIGHT.43 | v92.53,25.53 93.9,28.57 97,28.57 98.37,27.28 RIGHT.19
N$26  (via drill 0.3)
  Top 0.152: v79.86,33.38 83.21,30.02 93.19,30.02 95.86,27.36 RIGHT.20
  Bottom 0.152: v79.86,33.38 77.04,33.38 76.2,32.54 M5451_RIGHT.42
N$27  (via drill 0.3)
  Top 0.152: v80.01,34.44 81.23,33.22 81.23,32.99 83.21,31.01 97.23,31.01 98.37,29.87 RIGHT.21
  Bottom 0.152: v80.01,34.44 79.1,34.44 78.64,33.98 74.3,33.98 73.08,32.77 73.08,30.4 73.23,30.25 74.07,30.25 74.91,31.09 74.91,31.55 M5451_RIGHT.41
N$28  (via drill 0.3)
  Top 0.152: v79.32,33.91 80.09,33.91 80.92,33.07 80.92,32.84 83.06,30.71 95.02,30.71 RIGHT.22
  Bottom 0.152: v79.32,33.91 79.1,33.68 75.29,33.68 73.69,32.08 73.69,31.62 M5451_RIGHT.40
N$29  (via drill 0.3)
  Top 0.152: v80.54,35.43 80.77,35.43 83.67,32.54 92.63,32.54 92.66,32.54 93.6,32.54 94.69,33.63 96.44,33.63 97.74,32.38 98.37,32.38 RIGHT.23
  Bottom 0.152: v80.54,35.43 79.63,35.43 78.64,34.44 74.3,34.44 71.93,32.08 71.93,29.87 M5451_RIGHT.39
N$30  (via drill 0.3)
  Top 0.152: v78.11,34.98 80.24,34.98 81.53,33.68 81.53,33.15 82.98,31.7 95.17,31.7 95.86,32.38 RIGHT.24
  Bottom 0.152: 70.27,31.33 70.23,31.29 | 70.27,31.33 73.38,34.98 v78.11,34.98 | M5451_RIGHT.38 70.87,28.57 70.26,29.19 70.26,31.24 70.27,31.33
N$31  (via drill 0.3)
  Top 0.152: v73.84,27.36 73.91,33.68 75.97,37.49 94.23,37.49 94.56,37.82 95.4,38.66 96.39,38.66 97,38.05 97,36.35 97.46,35.89 RIGHT.25
  Bottom 0.152: v73.84,27.36 71.93,27.36 M5451_RIGHT.37
N$32  (via drill 0.3)
  Top 0.152: v82.17,34.98 83.59,33.5 84.2,33.22 91.11,33.22 91.14,33.22 92.28,33.22 93.95,34.9 95.86,34.9 RIGHT.26
  Bottom 0.152: v82.17,34.98 81.99,33.3 81.99,28.04 80.01,26.06 71.93,26.06 M5451_RIGHT.36
N$33  (via drill 0.3)
  Top 0.152: v82.25,24.77 83.95,24.77 85.06,25.86 89.38,25.88 94.61,20.68 98.75,20.7 99.67,21.62 99.67,36.2 98.45,37.41 RIGHT.27
  Bottom 0.152: M5451_RIGHT.35 v82.25,24.77
N$34  (via drill 0.3)
  Top 0.152: v75.51,22.25 75.51,33.63 76.25,35.41 76.66,36.22 77.37,36.22 82.32,35.92 84,35.53 90.58,35.56 94.36,35.92 95.83,37.46 RIGHT.28
  Bottom 0.152: v75.51,22.25 71.93,22.25 M5451_RIGHT.33
N$35  (via drill 0.3)
  Top 0.152: v80.11,23.95 80.14,23.95 82.45,26.52 90.22,26.52 90.65,26.49 v91.67,25.6
  Bottom 0.152: v91.67,25.6 91.67,26.9 | 91.67,26.9 91.67,26.82 91.67,26.87 91.67,26.9 | 91.67,26.9 91.67,32.71 | 91.67,32.71 91.67,32.74 | 91.67,32.71 91.67,32.74 | 91.67,32.71 91.67,32.74 | 91.67,32.74 91.67,34.34 93.8,37.19 95.71,39.09 97.46,39.09 98.37,40.01 RIGHT.29 | M5451_RIGHT.32 71.4,20.95 71.48,21.03 74.78,21.03 75.36,21.62 75.77,21.62 78.11,23.95 v80.11,23.95
N$36  (via drill 0.3)
  Top 0.152: v74.42,19.89 74.42,33.5 76.22,37.08 86.67,37.08 86.72,37.03 86.79,36.96 88.01,36.96 88.06,36.96 v90.98,36.96
  Bottom 0.152: 72.47,19.74 71.93,19.74 M5451_RIGHT.31 74.22,19.69 v74.42,19.89 | v90.98,36.96 93.62,37.57 95.86,40.01 RIGHT.30
N$37  (via drill 0.3)
  Top 0.152: v78.21,22.58 81.74,27.1 v84.2,27.1 | v87.12,34.49 92.46,34.49 v93.22,34.98
  Bottom 0.152: 72.47,18.44 71.93,18.44 M5451_RIGHT.30 72.47,18.44 | v84.2,27.1 84.51,28.7 84.51,30.61 84.51,33.4 85.6,34.49 v87.12,34.49 | v93.22,34.98 94.34,37.26 95.86,38.79 98.53,38.79 99.36,39.62 99.36,41.6 RIGHT.31 | 72.47,18.44 73.99,18.44 78.18,22.63 v78.21,22.58
N$38  (via drill 0.3)
  Top 0.152: v92.58,24.66 90.96,25.09 89.84,26.21 82.6,26.21 79.64,22.19 79.55,22.1 v79.65,22.15 | v97.16,25.93 97.16,27.36 98.68,28.88 98.75,28.88 99.36,29.49 99.36,35.28 98.53,36.12 97.89,36.12 97.31,37.08 97.31,38.53 97.16,40.18 95.94,42.52 RIGHT.32
  Bottom 0.152: v92.58,24.66 95.61,25.83 96.88,25.83 v97.16,25.93 | M5451_RIGHT.29 73.08,17.14 77.34,21.06 77.65,21.18 v79.65,22.15
N$39
  Bottom 0.152: 73.61,15.39 M5451_RIGHT.28 73.69,15.47 73.69,16.99 77.57,20.55 81.38,21.36 83.77,23.75 84.61,26.01 85.75,27.28 85.72,29.31 85.72,32.89 arc-90 86.26,33.43 86.94,33.43 88.24,34.72 88.24,36.8 90.75,39.39 93.95,39.39 96.16,41.6 96.24,41.6 97.46,42.82 97.46,44.12 RIGHT.33
N$40  (via drill 0.3)
  Top 0.152: v74.98,17.32 74.98,33.68 76.4,36.7 81.13,36.68 81.84,36.68 84.48,36.3 86.03,36.17 v89.41,36.2 | v90.83,38.71 90.83,39.24 95.86,44.27 95.86,45.03 RIGHT.34
  Bottom 0.152: v74.98,17.32 74.98,15.47 M5451_RIGHT.27 | v89.41,36.2 90.83,38.63 v90.83,38.71
N$41  (via drill 0.3)
  Top 0.152: v78.61,19.58 80.77,21.87 v83.13,24.23
  Bottom 0.152: v78.61,19.58 76.2,17.14 M5451_RIGHT.26 | v83.13,24.23 83.13,33.83 87.86,38.56 87.86,39.09 90.37,41.6 90.37,41.83 90.42,41.83 93.88,41.83 96.16,44.12 96.24,44.12 97.46,45.34 97.46,46.71 98.37,47.62 RIGHT.35
N$42
  Bottom 0.305: ROW_DRIVER.3 75.59,49.84 70.79,45.03 DRVR_BOT.6
N$43  (via drill 0.3)
  Top 0.152: U$3.2 28.35,5.49 28.35,8.69 U$6.IN2 28.42,8.76 28.42,9.98 29.03,10.59 33.76,10.59 33.78,10.59 34.39,11.89 34.39,12.55 35.13,13.31 36.4,13.31 36.75,12.93 41.35,12.93 42.82,11.45 43.81,11.45 43.81,11.51 44.04,11.51 45.49,12.95 45.49,13 45.7,13 46.35,13.66 46.35,15.75 v47.78,15.8 | v61.09,14.53 61.57,14.53 61.57,14.48 65.08,10.97 65.08,6.4 v65.1,6.4
  Bottom 0.152: 59.44,14.53 v59.44,16.84 58.34,18.24 50.42,18.24 48.59,16.54 47.83,15.77 47.78,15.77 v47.78,15.8 | 59.44,14.53 59.44,14.48 CPU.32 | 59.44,14.53 v61.09,14.53 | v65.1,6.4 69.01,1.04 74.83,1.04 85.67,1.02 85.72,1.07 85.72,4.42 IR_RECV.P$1_OUT
N$44  (via drill 0.3)
  Top 0.305: v74.91,50.14 75.51,50.14 78.11,52.73 ROW_DRIVER.5
  Bottom 0.305: v74.91,50.14 71.09,46.33 69.72,46.33 DRVR_BOT.7
N$45  (via drill 0.3)
  Top 0.152: v15.7,16.61 15.24,16.61 14.55,15.93 14.58,13.97 v13.08,12.47 | v29.97,18.44 29.95,18.44 25.98,18.44 25.15,17.6 v25.15,17.55
  Bottom 0.152: v29.97,18.44 31.93,16.48 33.55,16.48 34.85,16.48 35.48,15.93 37.49,15.88 38.3,16.03 41.27,16 42.44,17.83 M5451_LEFT.20 | v25.15,17.55 21.72,15.77 20.02,15.77 19.02,15.77 17.75,16.61 v15.7,16.61 | v13.08,12.47 12.42,11.81 11.2,11.81 7.72,11.81 7.7,11.81 7.7,8.76 3.81,4.88 3.81,4.5 LEFT.1
N$46  (via drill 0.3)
  Top 0.152: v24.89,19.3 v28.42,19.3 | v10.69,16.89 12.75,18.97 v14.02,18.97
  Bottom 0.152: v28.42,19.3 31.14,16.13 34.47,16.13 35.13,15.47 41.71,15.49 42.93,16.41 43.48,16.81 43.51,16.79 43.66,16.92 43.66,17.75 43.66,18.29 M5451_LEFT.19 | v24.89,19.3 20.5,16.1 19.38,16.1 19.38,17.53 15.6,18.99 | 15.6,18.99 15.6,19 | LEFT.2 1.29,4.5 2.46,5.74 4.22,5.74 5.36,6.88 5.41,6.93 5.41,12.27 9.75,16.61 10.44,16.61 10.67,16.84 v10.69,16.89 | v14.02,18.97 15.54,18.97 15.6,18.99
N$47  (via drill 0.3)
  Top 0.152: LEFT.3 3.81,7.01 5.44,8.05 5.38,12.5 13.03,20.22 14.2,20.22 v15.37,20.22 | v22.99,20.02 34.16,20.04 36.17,21.16 38.63,21.16 41.38,20.4 41.4,20.4 41.45,20.42 42.29,20.42 v42.34,20.4
  Bottom 0.152: 45.03,18.36 M5451_LEFT.18 44.96,18.36 44.96,18.82 43.74,20.04 v42.34,20.4 | v15.37,20.22 16.82,21.62 18.36,21.62 21.03,21.62 22.07,20.52 v22.99,20.02
N$48  (via drill 0.3)
  Top 0.152: v19.68,4.45 18.85,5.2 | 18.85,5.2 18.85,5.21 | v19.51,1.27 8.94,1.27 4.52,5.69 3.15,5.69 1.29,6.93 LEFT.4 | v46.41,18.14 38.18,18.14 36.35,16.31 36.35,16.23 36.04,15.93 25.15,15.93 21.57,12.34 21.59,8.89 21.57,8.84 19.58,8.84 18.9,8.15 18.9,5.26 18.85,5.2
  Bottom 0.152: v19.68,4.45 19.68,1.47 v19.51,1.27 | 46.71,20.04 M5451_LEFT.17
  Bottom 0.254: 46.71,20.04 46.71,18.9 v46.41,18.14
N$49
  Top 0.152: U$6.IN3 30.25,8.69 30.25,4.88 29.87,4.5 U$3.3
  Bottom 0.152: 59.97,13.87 CPU.1 60.04,13.84 60.71,13.84 60.86,13.99 61.42,13.99 61.77,14.35 61.77,14.86 61.72,14.86 61.72,15.16 59.97,16.92 59.97,17.3 58.75,18.52 58.73,18.57 50.11,18.57 47.88,16.33 46.66,16.33 45.21,14.88 44.68,14.88 44.46,14.67 44.45,13.06 44.45,10.9 44.5,10.9 42.67,9.07 42.67,8.25 43.2,7.72 43.2,7.01 42.6,6.4 38.56,6.4 38.25,6.1 31.5,6.1 29.9,4.5 29.87,4.5 U$3.3
N$50  (via drill 0.3)
  Top 0.152: v43.48,21.49 43.51,21.46 43.48,21.46 42.01,22.96 41.12,22.96 39.75,23.85 36.96,26.64 36.96,27.28 28.12,27.28 27.46,26.64 27.41,26.64 26.24,26.64 24.31,28.57 v20.95,28.57 | v10.26,21.64 10.26,21.77 v10.26,21.64 | LEFT.5 4.72,10.44 4.72,12.8 4.72,13.72 10.21,19.2 10.21,21.64 v10.26,21.64
  Bottom 0.152: v43.48,21.49 45.72,21.34 M5451_LEFT.16 | v20.95,28.57 16.54,28.57 10.29,22.33 10.29,21.64 v10.26,21.64
N$51  (via drill 0.3)
  Top 0.152: 1.22,9.52 LEFT.6 2.52,8.28 4.45,8.28 5.05,8.89 5.05,12.68 13.64,21.26 v15.34,21.26 | v38.46,22.45 35.51,22.45 34.21,21.16 24.21,21.16 23.98,20.93 v22.96,20.93
  Bottom 0.152: v38.46,22.45 41.48,24.33 42.62,24.33 43.54,24.33 44.45,24.33 44.42,24.33 45.11,23.49 45.11,22.71 45.19,22.63 46.71,22.63 M5451_LEFT.15 | v22.96,20.93 22.48,20.93 21.18,22.02 16.74,22 v15.34,21.26
N$52  (via drill 0.3)
  Top 0.152: v36.75,31.65 36.75,32.99 34.06,35.66 v14.63,35.66 | 9.37,21.51 v9.35,21.62 9.37,21.49 9.37,18.82 3.89,13.34 3.89,12.72 LEFT.7 3.86,12.72
  Bottom 0.152: v36.75,31.65 38.08,29.44 44.4,29.44 44.73,29.64 47.78,29.64 48.08,29.34 48.08,24.77 47.24,23.93 46.79,23.93 M5451_LEFT.14 | v14.63,35.66 14.63,33.45 13.64,32.46 13.64,26.75 9.37,22.48 9.37,21.64 v9.35,21.62
N$53  (via drill 0.3)
  Top 0.152: v23.65,21.59 34.06,21.59 36.07,23.62 37.31,23.62 37.34,23.62 37.8,23.62 v37.82,23.62
  Bottom 0.152: v37.82,23.62 41.22,25.15 M5451_LEFT.13 | v23.65,21.59 23.65,22.73 23.6,22.88 18.54,22.88 17.12,24.21 13.69,24.21 13.64,24.16 13.26,24.16 11.35,22.25 11.05,22.25 11,22.25 10.97,19.53 4.93,13.41 2.59,13.41 1.29,12.12 LEFT.8
N$54  (via drill 0.3)
  Top 0.152: v13.11,27.74 14.25,29.08 14.55,29.41 17.2,32.18 18.41,32.18 24.43,32.18 25.86,30.76 27.03,29.59 28.04,29.59 28.68,29.59 32.89,29.59 32.92,29.57 33.83,28.65 v35.89,28.65
  Bottom 0.152: v35.89,28.65 44.58,28.65 45.72,27.74 46.71,27.74 M5451_LEFT.11 | v13.11,27.74 13.11,27.13 12.19,26.21 12.19,25.76 7.87,21.44 7.87,18.64 6.53,17.32 LEFT.9
N$55  (via drill 0.3)
  Top 0.152: v11.89,27.96 12.34,28.35 16.54,32.54 16.84,32.54 16.87,32.54 24.56,32.54 25.96,31.12 25.98,31.09 26.9,30.17 32.77,30.17 33.22,29.72 35.89,29.72 v35.92,29.69
  Bottom 0.152: v35.92,29.69 36.88,29.08 44.48,29.08 44.96,28.96 M5451_LEFT.10 | v11.89,27.96 11.89,25.98 6.91,20.98 6.91,18.67 4.19,15.95 2.59,15.95 LEFT.10
N$56  (via drill 0.3)
  Top 0.152: v6.22,21.62 6.22,19.46 LEFT.11 | v40.08,30.02 36.91,30.02 36.6,30.33 33.38,30.33 33.2,30.51 32,30.51 31.73,30.78 29.26,30.78 28.27,31.77 26.16,31.77 24.94,32.89 16.33,32.89 14.71,31.24 13.82,31.24 v9.2,26.42
  Bottom 0.152: v6.22,21.62 6.2,21.89 6.25,21.92 6.22,21.84 9.16,24.5 9.2,24.79 v9.2,26.42 | M5451_LEFT.9 46.71,30.25 46.71,30.2 44.09,30.2 43.92,30.02 40.34,30.02 40.31,30.02 v40.08,30.02
N$57  (via drill 0.3)
  Top 0.152: v37.64,31.67 37.64,32.54 33.91,36.27 v32.61,36.27 | v12.04,37.41 v15.24,40.62
  Bottom 0.152: v32.61,36.27 28.27,40.62 26.16,40.62 24.66,39.98 19.05,39.98 18.06,40.64 v15.24,40.62 | M5451_LEFT.8 46.71,31.47 46.05,31.62 45.21,31.62 42.62,30.63 42.6,30.63 38.63,30.63 37.64,31.62 v37.64,31.67 | LEFT.12 1.29,17.14 2.52,18.36 3.81,18.36 9.75,24.31 9.75,29.57 9.75,35.13 v12.04,37.41
N$58  (via drill 0.3)
  Top 0.152: v36.09,32.46 33.53,32.77 31.17,35.13 10.06,35.13 v9.07,34.14 | v8.84,29.72 7.54,29.72 3.81,25.98 1.14,25.98 0.3,25.15 0.3,21.87 1.52,20.65 2.9,20.65 3.81,19.74 LEFT.13
  Bottom 0.152: v9.07,34.14 9.07,32 9.07,31.52 9.07,29.92 v8.84,29.72 | M5451_LEFT.7 46.71,32.77 44.86,32.77 41.3,31.14 41.27,31.14 38.68,31.14 38.66,31.14 38.05,32.44 36.6,32.49 v36.09,32.46
N$59  (via drill 0.3)
  Top 0.152: v7.32,43.2 4.5,43.2 4.19,43.51 0.91,43.51 0.3,42.9 0.3,33.83 v0.46,33.68
  Bottom 0.152: v7.32,43.2 19.05,43.2 22.86,40.54 24.64,40.54 25.73,41.3 35.89,41.3 36.98,40.18 38.66,40.18 41.6,37.26 41.76,37.11 43.28,37.11 44.81,35.59 44.96,34.52 M5451_LEFT.6 | v0.46,33.68 0.46,32.92 0.3,32.77 0.3,20.65 LEFT.14
N$60  (via drill 0.3)
  Top 0.152: v39.12,31.7 38.15,30.94 36.52,30.94 32.79,30.94 29.54,31.95 29.46,32.11 28.27,33.3 27.74,33.83 15.62,33.83 v15.39,33.6 | v14.17,32.23 6.17,24.23 4.19,22.25 3.81,22.25 LEFT.15
  Bottom 0.152: v39.12,31.7 40.62,31.7 41.43,31.7 42.42,32.18 43.66,33.68 43.66,34.44 M5451_LEFT.5 | v15.39,33.6 15.39,33.45 v14.17,32.23
N$61  (via drill 0.3)
  Top 0.152: v34.06,25.15 34.06,24.69 33.38,24 31.8,22.25 v22.86,22.3 | LEFT.16 2.26,21.13 3.07,21.13 3.35,20.95 4.22,20.95 5.51,22.25 7.24,22.25 14.66,22.25 v15.34,22.25 | v41.99,32.77 41.99,29.49 41.99,28.27 41.53,27.81 v41.48,27.76
  Bottom 0.152: v41.99,32.77 42.44,33.22 M5451_LEFT.4 | v15.34,22.25 17.32,22.45 22.68,22.45 v22.86,22.3 | v41.48,27.76 41.45,27.81 40.62,27.81 36.73,27.81 v34.06,25.15
N$62  (via drill 0.3)
  Top 0.152: v39.12,32.56 38.94,32.84 34.98,36.8 26.59,36.8 25.98,36.2 11.28,36.2 10.52,35.43 8.46,35.43 v7.64,34.62
  Bottom 0.152: v39.12,32.56 40.51,32.56 41.15,33.91 41.15,34.44 M5451_LEFT.3 | v7.64,34.62 7.64,28.68 LEFT.17
N$63  (via drill 0.3)
  Top 0.152: v36.88,36.65 35.59,36.65 35.13,37.11 26.44,37.11 25.83,36.5 11.12,36.5 10.97,36.35 v8.56,36.35 | v8.2,28.93 7.16,28.88 3.96,25.68 2.21,25.68 1.29,24.77 LEFT.18
  Bottom 0.152: v36.88,36.65 37.34,35.2 37.34,34.52 M5451_LEFT.44 | v8.56,36.35 8.2,36.02 8.2,35.26 v8.2,28.93
N$64  (via drill 0.3)
  Top 0.152: v35.51,31.62 33.6,32.23 31.85,33.98 28.5,33.98 28.04,34.44 10.59,34.44 9.45,33.3 7.29,33.3 v7.01,32.99
  Bottom 0.152: v35.51,31.62 35.51,32.84 36.04,33.38 36.04,34.44 M5451_LEFT.43 | v7.01,32.99 7.01,30.56 3.81,27.36 LEFT.19
N$65  (via drill 0.3)
  Top 0.152: v33.68,37.8 26.54,37.82 25.83,37.11 13.18,37.11 v13.11,37.19 | v10.52,30.25 9.75,30.25 7.16,30.25 5.33,28.42 2.52,28.42 1.29,27.36 LEFT.20
  Bottom 0.152: v33.68,37.8 34.82,36.68 34.82,34.98 M5451_LEFT.42 | v13.11,37.19 13.11,34.37 13.11,33.27 13.11,32.82 11.28,31.01 v10.52,30.25
N$66  (via drill 0.3)
  Top 0.152: v32.54,32.33 29.72,32.36 27.89,34.14 12.12,34.14 10.44,32.46 6.27,32.46 5.44,31.62 5.41,31.62 3.81,30.02 3.81,29.87 | 3.81,29.87 LEFT.21 3.81,29.87
  Bottom 0.152: v32.54,32.33 33.53,33.98 33.53,34.44 M5451_LEFT.41
N$67  (via drill 0.3)
  Top 0.152: v30.02,34.52 28.42,34.52 28.12,34.82 10.52,34.82 9.3,33.6 1.14,33.6 0.3,32.77 0.3,30.78 1.22,29.87 LEFT.22
  Bottom 0.152: v30.02,34.52 32.23,34.52 M5451_LEFT.40
N$68  (via drill 0.3)
  Top 0.152: v28.27,39.85 25.07,43.05 14.63,43.05 9.83,38.25 7.54,38.25 v7.47,38.33
  Bottom 0.152: v28.27,39.85 28.27,35.51 30.48,33.3 30.48,32.77 M5451_LEFT.39 | v7.47,38.33 7.47,38.02 4.72,35.28 4.72,33.3 LEFT.23
N$69  (via drill 0.3)
  Top 0.152: v27.74,33.07 27.74,33.05 27.23,33.53 16.1,33.53 15.62,33.07 12.27,33.07 11.35,32.16 6.63,32.16 5.79,31.32 5.79,30.48 4.19,28.88 3.43,28.88 2.21,30.1 2.21,31.47 1.29,32.38 LEFT.24
  Bottom 0.152: v27.74,33.07 29.26,31.55 30.48,31.55 M5451_LEFT.38
N$70  (via drill 0.3)
  Top 0.152: v26.59,39.52 26.59,41.05 24.92,42.75 15.7,42.75 11.89,38.94 9.83,36.88 5.71,36.88 3.81,34.98 LEFT.25
  Bottom 0.152: 31.55,30.17 30.56,30.17 M5451_LEFT.37 30.48,30.25 28.73,31.12 26.62,33.4 26.59,33.41 v26.59,39.52
N$71  (via drill 0.3)
  Top 0.152: v28.42,28.96 27.2,28.96 24.31,31.85 17.8,31.83 v17.42,31.52 | v6.04,38.35 3.58,35.89 2.21,35.89 1.29,34.98 LEFT.26
  Bottom 0.152: v17.42,31.52 17.42,33.78 12.68,38.41 10.46,38.41 9.53,39.32 7.01,39.32 v6.04,38.35 | v28.42,28.96 M5451_LEFT.36
N$72  (via drill 0.3)
  Top 0.152: 7.44,41.15 8.03,41.15 7.44,41.15 | 7.44,41.15 v9.37,41.15 | 7.44,41.15 5.08,38.73 3.81,37.49 LEFT.27
  Bottom 0.152: 24.71,39.42 26.14,38 26.14,30.48 28.88,27.74 30.48,27.74 M5451_LEFT.35 | 24.71,39.42 24.74,39.42 24.71,39.42 | v9.37,41.15 11.63,41.12 12.72,40.03 17.78,40.06 18.49,39.42 23.9,39.42 24.71,39.42
N$73  (via drill 0.3)
  Top 0.152: v26.67,32.44 26.64,32.41 25.22,33.2 16.2,33.2 15.77,32.77 13.03,32.77 12.42,32.18 11.4,31.14 8.53,31.14 v6.38,31.14
  Bottom 0.152: v26.67,32.44 29.34,29.64 31.62,29.64 31.93,29.34 31.93,26.06 31.01,25.15 M5451_LEFT.33 | v6.38,31.14 4.8,31.14 4.09,31.14 3.02,31.14 2.52,32.38 2.52,36.2 1.29,37.41 LEFT.28
N$74  (via drill 0.3)
  Top 0.152: v24.08,31.32 v27.38,27.91
  Bottom 0.152: v27.38,27.91 27.38,27.86 27.79,27.46 27.79,24.87 28.7,23.93 30.02,23.93 30.48,23.93 M5451_LEFT.32 | v24.08,31.32 24.08,38.18 23.24,39.01 17.86,39.01 16.87,39.67 10.92,39.7 10.19,40.44 10.13,40.46 5.33,40.46 4.88,40.01 LEFT.29
N$75  (via drill 0.3)
  Top 0.152: v26.8,27.2 26.21,27.38 22.43,31.24 v21.03,31.24
  Bottom 0.152: v26.8,27.2 27.3,26.34 27.3,24.56 29.26,22.66 30.48,22.63 M5451_LEFT.31 | v21.03,31.24 21.03,34.47 16.69,38.76 10.67,38.76 9.73,39.67 6.53,39.67 5.16,38.61 2.44,38.61 LEFT.30
N$76  (via drill 0.3)
  Top 0.152: v34.44,28.12 35.87,28.12 35.89,28.12 39.93,28.12 40.62,28.8 40.64,28.83 40.66,34.16 30.66,44.12 13.72,44.12 12.19,42.6 3.81,42.6 LEFT.31
  Bottom 0.152: v34.44,28.12 32.31,25.98 32.31,22.63 31.01,21.34 M5451_LEFT.30
N$77  (via drill 0.3)
  Top 0.152: v23.32,31.32 v26.42,28.12
  Bottom 0.152: v26.42,28.12 26.21,27.91 26.21,26.75 26.67,26.29 26.67,23.47 30.02,20.12 30.48,20.12 M5451_LEFT.29 | v23.32,31.32 23.32,38.18 17.91,38.18 16.82,39.27 10.64,39.27 9.75,40.16 5.79,40.16 4.6,38.96 3.23,38.96 2.46,39.73 2.46,41.35 LEFT.32
N$78  (via drill 0.3)
  Top 0.152: v36.96,39.37 35.87,40.23 30.86,45.16 16.1,45.16 14.63,46.63 8.71,46.66 7.24,45.11 3.81,45.11 LEFT.33
  Bottom 0.152: v36.96,39.37 35.99,38.28 35.36,37.29 35.36,36.88 35.36,33.3 34.98,32.92 34.98,27.89 32.8,25.72 32.84,25.68 32.84,20.8 32.84,20.75 32.84,20.73 32.31,20.19 32.31,18.36 M5451_LEFT.28 32.23,18.36
N$79  (via drill 0.3)
  Top 0.152: v33.53,23.01 35.15,24.84 v36.96,24.84 | LEFT.34 1.29,45.03 2.21,44.12 6.86,44.12 8.99,46.23 13.74,46.2 15.29,44.63 25.6,44.6 30.63,44.6 30.71,44.58 30.73,44.55 38.12,37.19 39.8,35.53 39.85,35.59 41.07,34.37 41.12,34.31 41.12,28.75 41.07,28.73 40.39,28.04 40.39,27.28 v40.34,27.23
  Bottom 0.152: v33.53,23.01 33.53,21.89 33.53,21.44 33.53,19.2 33.53,18.36 M5451_LEFT.27 | v36.96,24.84 39.32,27.2 40.31,27.2 v40.34,27.23
N$80  (via drill 0.3)
  Top 0.152: v54.41,1.37 55.93,2.9 55.93,4.5 60.27,8.84 64.01,8.84 64.57,9.4 64.57,10.79 61.9,13.46 v61.24,13.46 | U$3.4 32.38,4.5 32.23,4.65 32.23,8.69 U$6.IN4 32.21,9.91 33.96,9.91 34.77,10.9 34.77,12.47 35.28,12.98 35.94,12.98 36.5,12.55 40.03,11.33 41.38,11.33 41.66,11.61 v41.91,11.61
  Bottom 0.152: v54.41,1.37 47.32,1.37 46.79,0.84 34.14,0.81 33.66,1.29 33.66,2.46 32.38,3.73 U$3.4 | CPU.2 60.05,13.34 60.43,13.34 61.11,13.34 arc90 v61.24,13.46 | U$5.2_DATA_DFLT 42.7,10.87 v41.91,11.61 | U$6.IN4 31.55,8.71 31.55,8.76 30.86,9.45 29.11,9.45 27.96,10.59 27.96,10.9 U$7.OUT2_DFLT
N$81  (via drill 0.3)
  Top 0.203: v59.21,8.53 59.21,8.31 55.55,4.65 55.55,4.11 53.11,1.68 40.23,1.68 U$3.6 35.97,5.94 35.97,8.69 U$6.IN6
  Top 0.254: U$6.IN6 36.02,9.65 37.29,10.92 44.88,10.92 v45.72,10.08
  Bottom 0.203: v59.21,8.53 59.21,8.76 58.98,8.99 58.98,9.68 CPU.10 | U$7.OUT1_DFLT 30.48,10.9 30.71,10.41 31.52,9.6 34.52,9.6 35.97,8.76 U$6.IN6
  Bottom 0.254: v45.72,10.08 U$5.3_STROBE_DFLT
N$82  (via drill 0.3)
  Top 0.152: v21.44,7.62 21.26,7.29 20.78,5.99 20.78,3.99 21.59,3.18 35.36,3.18 36.52,2.16 | 36.52,2.16 36.52,2.21 | v63.7,2.67 69.7,8.71 70.64,9.65 70.64,9.68 71.02,10.06 71.7,10.06 v71.73,10.08 | 36.52,2.16 v38.81,2.13
  Bottom 0.152: CY7C64316.P$1 20.26,9.61 21.03,8.84 21.44,8.43 v21.44,7.62 | v71.73,10.08 75.23,10.06 USBLED_R.1 | v63.7,2.67 48.16,2.67 47.62,2.16 v38.81,2.13
N$83  (via drill 0.3)
  Top 0.254: v12.5,8.97 9.22,8.97 USBID.JPR
  Bottom 0.254: USB_CON.4 12.51,8.85 v12.5,8.97
N$84  (via drill 0.3)
  Top 0.203: v55.63,5.64 v57.84,7.85 | v47.4,6.45 v51.97,6.55 | U$6.IN8 39.85,8.69 39.85,7.98 43.33,4.47 44.42,4.5 U$3.8
  Bottom 0.203: U$5.1_CLK_DFLT 40.64,9.55 U$6.IN8 | v57.84,7.85 57.84,9.68 CPU.12 | v55.63,5.64 52.88,5.64 v51.97,6.55 | U$3.8 v47.4,6.45
N$85  (via drill 0.3)
  Top 0.203: v56.77,7.62 56.46,7.62 53.34,4.5 53.34,3.89 51.74,2.29 47.4,2.29 47.02,2.67 47.02,4.42 U$3.9 46.1,5.33 43.13,5.33 41.15,7.29 41.15,7.98 41.22,8 41.68,8.46 41.68,8.69 U$6.IN9
  Bottom 0.203: v56.77,7.62 56.77,7.77 57.38,8.38 57.38,9.68 CPU.13
N$86  (via drill 0.3)
  Top 0.203: 49.53,4.5 50.75,4.5 54.56,8.31 v55.24,8.31 55.32,8.31 | 49.53,4.5 U$3.10 | v38.08,9.86 41.86,9.86 41.91,9.83 43.28,8.46 U$6.IN10 | U$6.IN10 43.66,8.69 | 49.53,4.5 48.41,4.5 47.14,5.77 43.33,5.77 41.81,7.29 41.81,7.57 42.14,7.9 42.82,7.9 U$6.IN10
  Bottom 0.203: v55.24,8.31 55.47,8.08 56.16,8.08 56.84,8.76 56.84,9.68 CPU.14 | v38.08,9.86 36.98,10.95 SJ1.DEFAULT | U$3.10 49.53,4.5
N$87
  Bottom 0.305: DRVR_BOT.8 69.72,47.62 69.72,47.78 74.45,52.5 74.45,53.19 75.13,53.87 79.48,53.87 80.62,52.73 ROW_DRIVER.7
N$88
  Bottom 0.305: ROW_DRIVER.9 78.94,48.46 78.94,47.62 DRVR_BOT.9
N$89  (via drill 0.3)
  Top 0.305: v83.9,50.9 85.72,52.73 ROW_DRIVER.11
  Bottom 0.305: v83.9,50.9 80.92,47.93 80.92,47.62 79.63,46.33 78.94,46.33 DRVR_BOT.10
N$90  (via drill 0.3)
  Top 0.152: v23.55,10.79 23.65,10.77 | 23.65,10.77 23.6,10.79 | 23.65,10.77 25.27,10.77 27.61,13.11 29.46,13.11 29.49,13.11 30.1,13.72 30.63,13.72 30.94,14.02 33.07,14.02 v33.07,14.05
  Bottom 0.152: v23.55,10.79 21.57,11.28 20.95,11.28 CY7C64316.P$15 | v33.07,14.05 33.07,13.26 U$7.OUT0_DFLT1
N$91  (via drill 0.3)
  Top 0.152: v78.82,7.11 78.82,5.97 78.79,4.83 PWR_LED.A
  Bottom 0.152: v78.82,7.11 78.82,8.38 PWRLED_R.2
N$92  (via drill 0.3)
  Top 0.152: v64.36,55.4 62.03,55.4 LED_VADJ.P$2 | v63.07,51.69 63.02,51.66 59.13,47.78 59.13,37.87 60.81,36.2 60.81,35.36 v60.81,35.26
  Bottom 0.152: v64.36,55.4 64.62,55.17 64.62,53.54 63.96,52.43 63.12,51.74 63.14,51.71 v63.07,51.69 | v60.81,35.26 58.5,32.99 58.5,32.89 58.5,31.29 59.51,30.33 | LEDVREG.1 62.03,31.55 60.66,31.55 59.51,30.4 59.51,30.33 | VADJ_R.2 59.51,30.33
N$93  (via drill 0.3)
  Top 0.152: v28.47,26.75 v36.42,26.75 | v25.3,37.64 23.44,37.67 23.39,37.72 20.57,40.54 20.12,40.54 v20.12,40.56
  Bottom 0.152: v36.42,26.75 36.42,22.4 34.82,20.8 34.82,19.28 M5451_LEFT.26 | v28.47,26.75 28.5,27.66 25.83,30.33 25.83,37.11 v25.3,37.64 | LEFT.35 4.72,46.71 4.72,45.03 8.08,41.68 17.6,41.68 18.67,40.62 20.12,40.62 v20.12,40.56
N$94  (via drill 0.3)
  Top 0.152: v43.13,14.5 43.03,14.66 36.85,14.66 36.65,14.45 33.73,14.45 33.53,14.66 32.89,14.66 32.84,14.63 30.79,14.63 30.48,14.33 v30.43,14.27 30.4,14.25 30.18,14.25 29.64,13.72 25.91,13.72 23.93,11.73 22.94,11.73 v22.91,11.68
  Bottom 0.152: v22.91,11.68 21.79,11.81 20.95,11.81 CY7C64316.P$14 | v30.43,14.27 30.45,13.66 30.48,13.26 U$7.OUT1_DFLT1 | U$5.2_DATA_DFLT1 43.13,13.44 v43.13,14.5
N$95
  Bottom 0.152: CY_PRG_MINI.1 18.67,15.24 19.74,14.17 19.74,13.03 CY7C64316.P$11
N$96  (via drill 0.3)
  Top 0.305: v80.62,45.03 v86.94,51.36
  Bottom 0.305: v86.94,51.36 88.32,52.73 ROW_DRIVER.13 | DRVR_BOT.11 v80.62,45.03
N$97  (via drill 0.3)
  Top 0.152: 50.06,46.71 50.06,46.86 VD0.2 50.06,46.71 | v54.41,14.78 54.41,40.77 51.21,43.97 51.21,45.57 50.06,46.71
  Bottom 0.152: v54.41,14.78 54.41,13.87 54.94,13.34 55.24,13.34 CPU.23 | U$3.A_0 34.98,52.65 36.04,52.65 37.03,51.66 43.51,51.66 43.89,52.04 44.42,52.04 49.61,46.86 VD0.2
N$98  (via drill 0.3)
  Top 0.152: v53.87,15.44 53.87,15.93 54.1,16.15 54.1,29.87 v52.35,31.52
  Bottom 0.152: v53.87,15.44 54.76,15.44 55.24,14.99 55.24,13.87 CPU.24 | VD1.2 50.06,45.03 | U$3.A_1 32.38,51.43 32,51.05 32,47.55 32.69,46.86 36.2,46.86 38,48.67 38.11,48.76 38.18,48.77 39.19,48.77 40.46,47.47 41.99,45.97 46.05,45.97 49.84,45.11 49.99,45.11 VD1.2 | v52.35,31.52 52.32,31.55 51.89,31.95 51.89,32.16 51.89,43.13 50.06,44.96 VD1.2
N$99  (via drill 0.3)
  Top 0.152: v52.98,16.26 53.01,17.3 53.01,18.72 52.96,18.74 52.96,19.28 51.05,21.18 51.05,24.38 v51.03,24.38